# EasyEDA schematic SCH_carw_2026-01-21.json
TITLE: Sheet_1; REV: 1.0; Date: 2025-05-06; Sheet: 1/1; Drawn By: adnanalahdab03; Company: Your Company
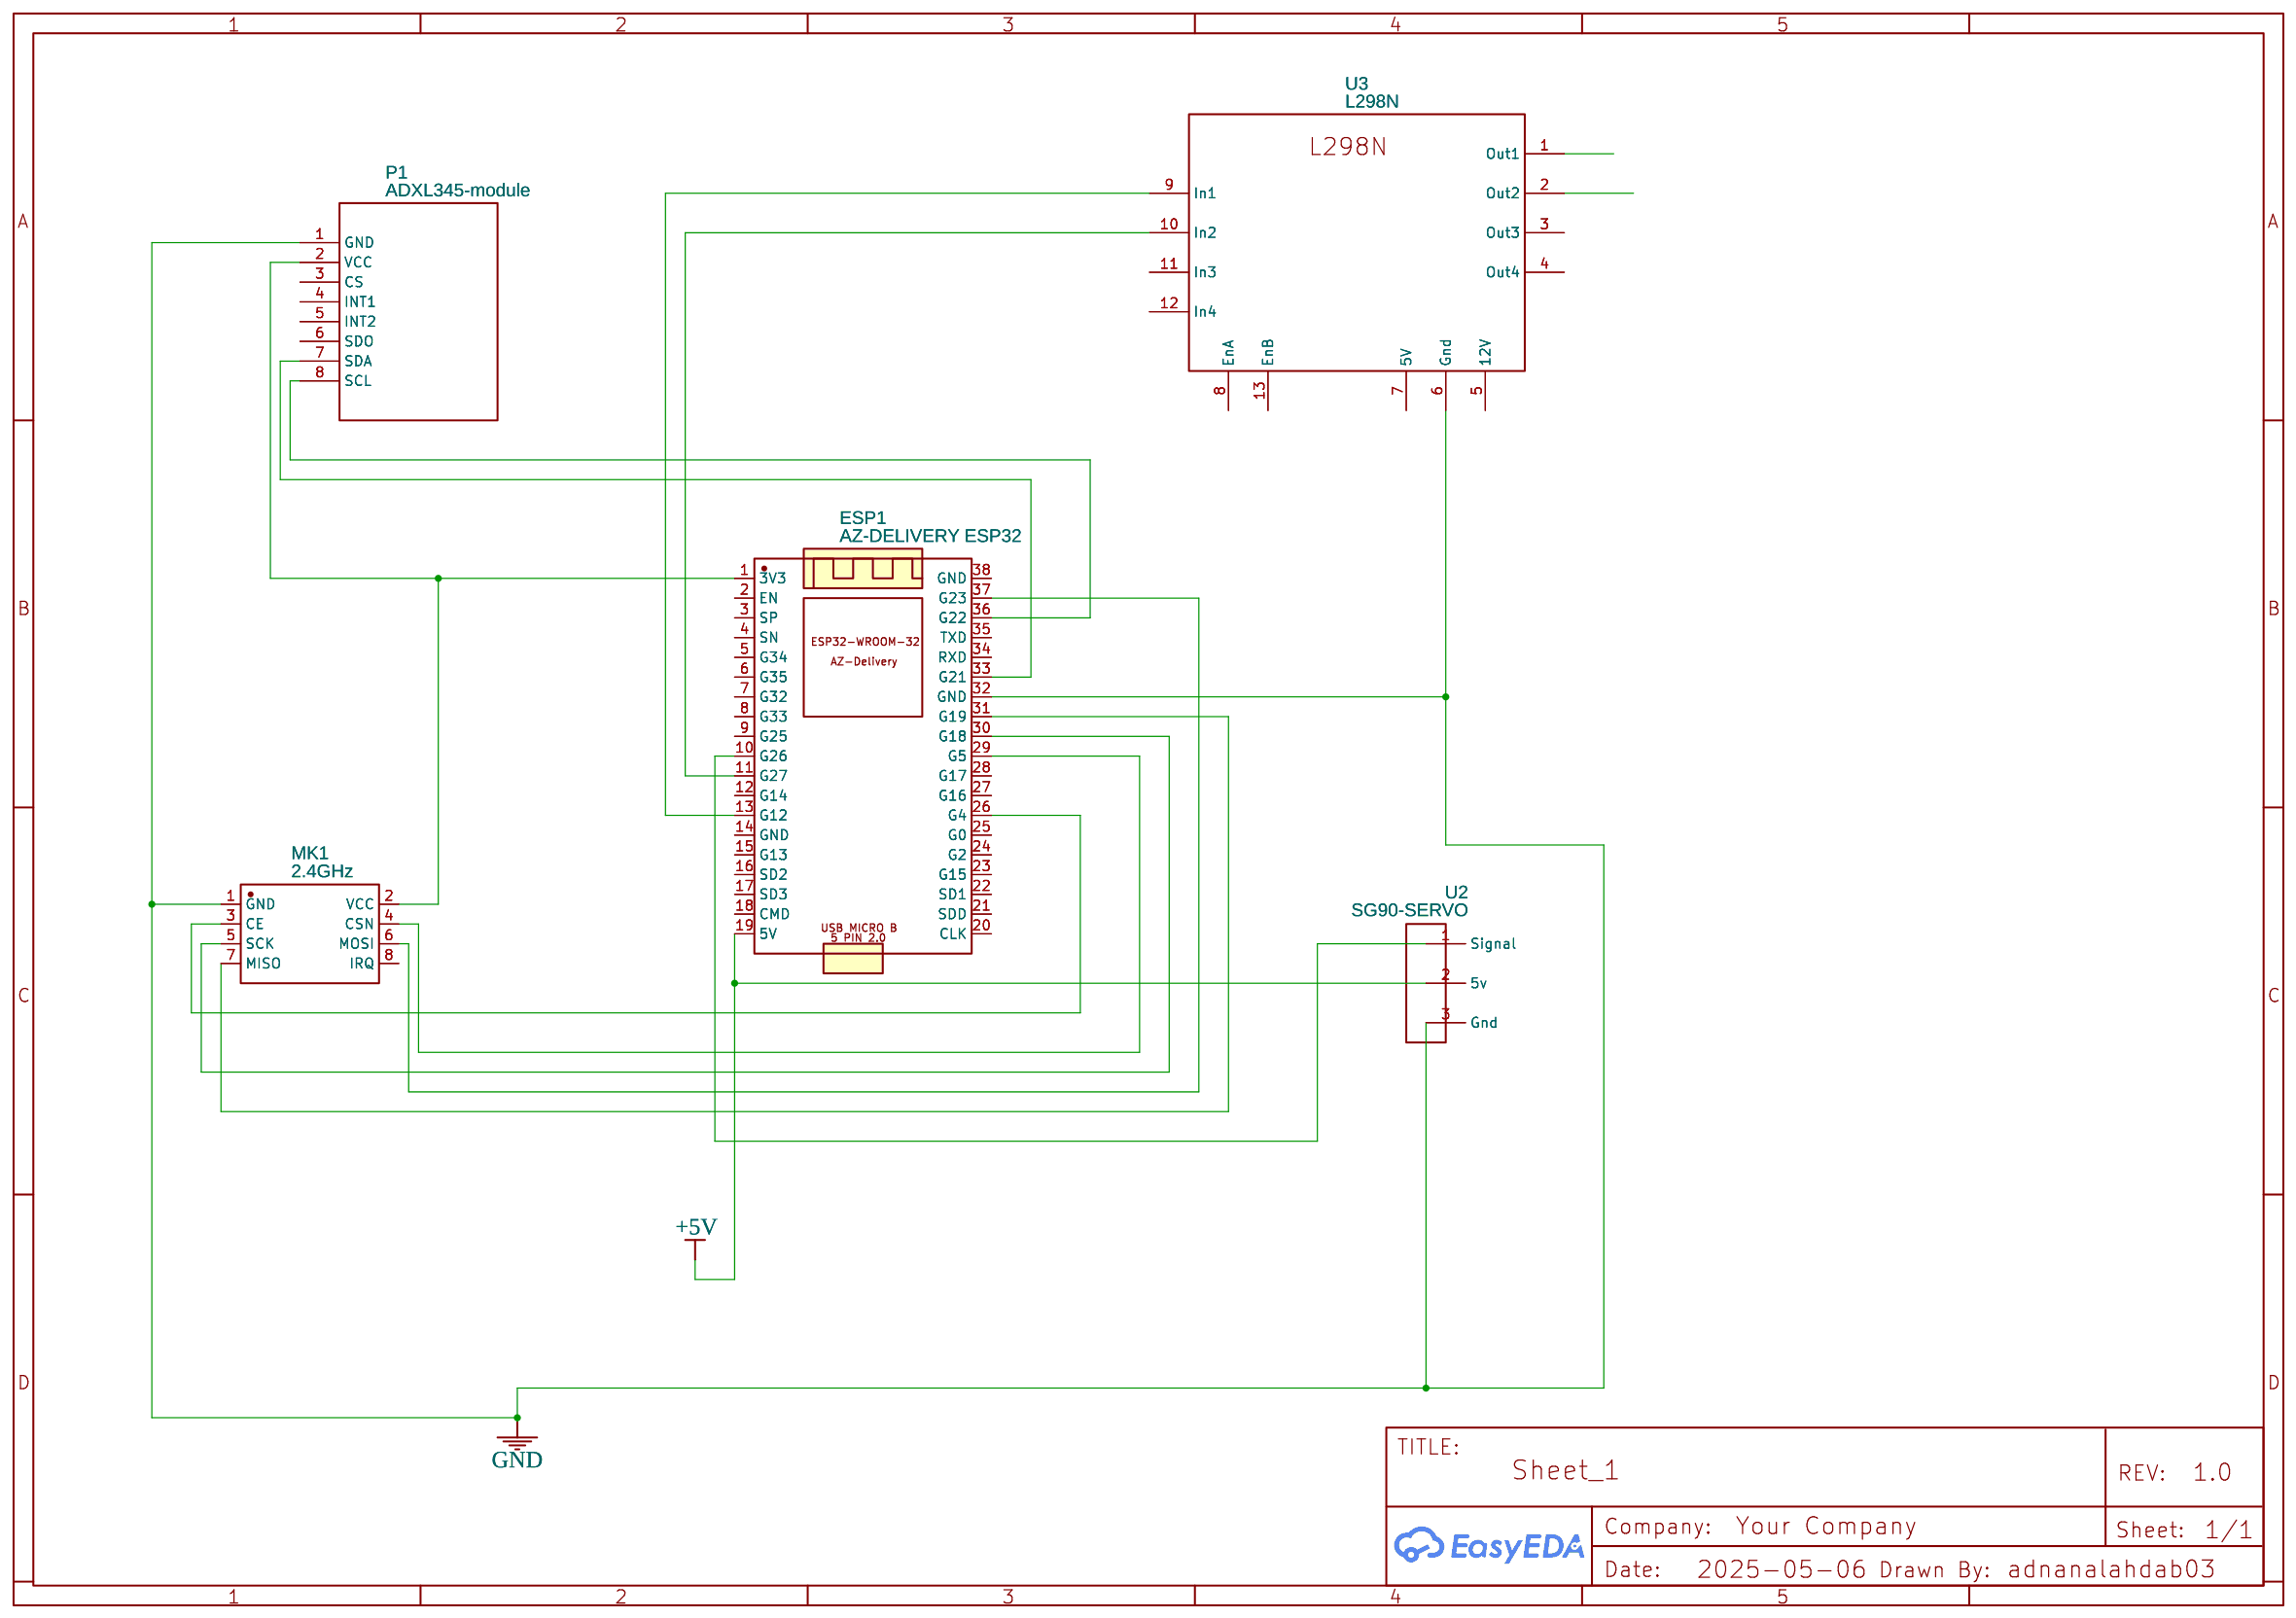
[diagram p0: schematic sheet]

## Parts
ESP1  AZ-DELIVERY ESP32  [AZ-DELIVERY ESP32]
MK1  2.4GHz  [WIRELM-SMD_L28.6-W15.3-P2.54_NRF24L01]
P1  ADXL345-module  [ADXL345-W-HOLE]
U2  SG90-SERVO  [SG90-SERVO]
U3  L298N  [L298N]

## Library data of the parts
ESP1 = AZ-DELIVERY ESP32: Manufacturer: AZ-DELIVERY; Supplier: AZ-DELIVERY; Supplier Part: ESP32 NodeMCU; Contributor: herrtechniker
MK1 = NRF24L01: Supplier: LCSC; Manufacturer: Ai-Thinker(安信可); Manufacturer Part: NF-04; Supplier Part: C90751; JLCPCB Part Class: Extended Part
P1 = ADXL345-module: sourceId: 1T5FDZYC8; Contributor: crying_cat
U2 = SG90-SERVO: Contributor: Nealandertal
U3 = L298N: Contributor: xanderevg

## Nets
+5V: ESP1.19(5V) U2.2(5v)
GND: ESP1.32(GND) MK1.1(GND) P1.1(GND) U2.3(Gnd) U3.6(Gnd)
Net-(ESP1-1): ESP1.1(3V3) MK1.2(VCC) P1.2(VCC)
Net-(ESP1-10): ESP1.10(G26) U2.1(Signal)
Net-(ESP1-11): ESP1.11(G27) U3.10(In2)
Net-(ESP1-13): ESP1.13(G12) U3.9(In1)
Net-(ESP1-26): ESP1.26(G4) MK1.3(CE)
Net-(ESP1-29): ESP1.29(G5) MK1.4(CSN)
Net-(ESP1-30): ESP1.30(G18) MK1.5(SCK)
Net-(ESP1-31): ESP1.31(G19) MK1.7(MISO)
Net-(ESP1-33): ESP1.33(G21) P1.7(SDA)
Net-(ESP1-36): ESP1.36(G22) P1.8(SCL)
Net-(ESP1-37): ESP1.37(G23) MK1.6(MOSI)

Not connected (* = marked no-connect by the designer): ESP1 2(EN) 3(SP) 4(SN) 5(G34) 6(G35) 7(G32) 8(G33) 9(G25) 12(G14) 14(GND) 15(G13) 16(SD2) 17(SD3) 18(CMD) 20(CLK) 21(SDD) 22(SD1) 23(G15) 24(G2) 25(G0) 27(G16) 28(G17) 34(RXD) 35(TXD) 38(GND); MK1 8(IRQ); P1 3(CS) 4(INT1) 5(INT2) 6(SDO); U3 1(Out1) 2(Out2) 3(Out3) 4(Out4) 5(12V) 7(5V) 8(EnA) 11(In3) 12(In4) 13(EnB)
